# Altium schematic sheet OLED.SchDoc
size Letter
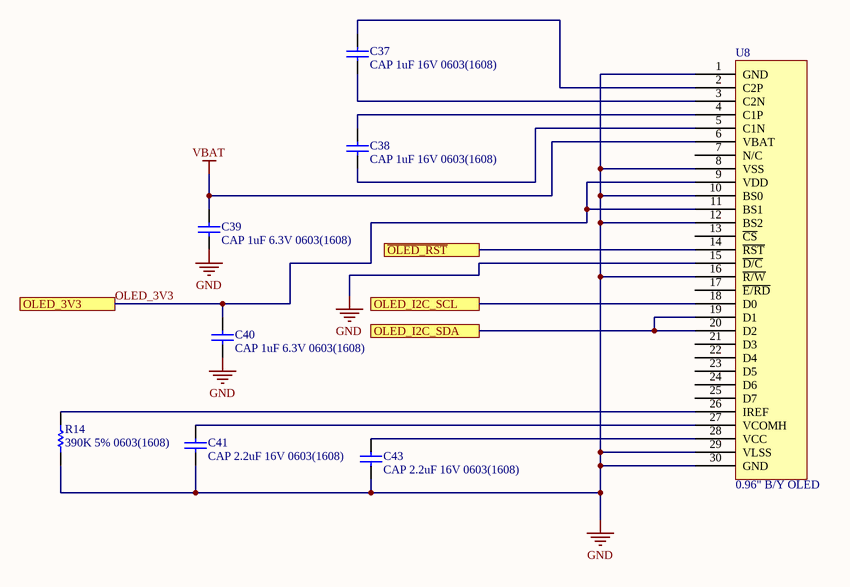
[diagram p0: OLED.SchDoc]

## Parts
C37  CAP 1uF 16V 0603(1608)  [CAPC0603(1608)100_L]
C38  CAP 1uF 16V 0603(1608)  [CAPC0603(1608)100_L]
C39  CAP 1uF 6.3V 0603(1608)  [CAPC0603(1608)100_L]
C40  CAP 1uF 6.3V 0603(1608)  [CAPC0603(1608)100_L]
C41  CAP 2.2uF 16V 0603(1608)  [CAPC0603(1608)55_L]
C43  CAP 2.2uF 16V 0603(1608)  [CAPC0603(1608)55_L]
R14  390K 5% 0603(1608)  [RESC0603(1608)_N]
U8  0.96" B/Y OLED  [0.96" B/Y OLED]

## Ports
OLED_3V3, OLED_I2C_SCL, OLED_I2C_SDA, ~{OLED_RST}

## Nets
GND: C39.1 C40.1 C41.1 C43.1 R14.1 U8.1(GND) U8.8(VSS) U8.10(BS0) U8.12(BS2) U8.15(~{D/C}) U8.16(~{R/W}) U8.29(VLSS) U8.30(GND)
VBAT: C39.2 U8.6(VBAT)
~{OLED_RST}: U8.14(~{RST}) ; port ~{OLED_RST}
OLED_3V3: C40.2 U8.9(VDD) U8.11(BS1) ; port OLED_3V3
OLED_I2C_SCL: U8.18(D0) ; port OLED_I2C_SCL
OLED_I2C_SDA: U8.19(D1) U8.20(D2) ; port OLED_I2C_SDA
NetC37_1: C37.1 U8.3(C2N)
NetC37_2: C37.2 U8.2(C2P)
NetC38_1: C38.1 U8.5(C1N)
NetC38_2: C38.2 U8.4(C1P)
NetC41_2: C41.2 U8.27(VCOMH)
NetC43_2: C43.2 U8.28(VCC)
NetR14_2: R14.2 U8.26(IREF)

Not connected (* = marked no-connect by the designer): U8 7(N/C) 13(~{CS}) 17(~{E/RD}) 21(D3) 22(D4) 23(D5) 24(D6) 25(D7)

## Notes on the sheet
- Title
- Size:
- Date:
- Letter
- Number:
- Time:
- Revision:
- Sheet
- of
- Copyright 2019
- Specialized Solutions LLC
- 206 W Lincoln Hwy STE B
- New Haven, IN 46774
- www.specsolns.com <http://www.specsolns.com>
- File:

## Library data of the parts
C37 C38 = CMP-1035-02738-1: CAP 1uF 16V ±20% 0603 (1608 Metric) Thickness 1mm SMD; Case-Metric: 1608; Case-EIA: 0603; Tolerance: Â±20%; Value: 1uF; Rated Voltage: 16 V; Max Thickness: 1 mm; Technology: SMT
C39 C40 = CMP-1035-02731-1: CAP 1uF 6.3V ±20% 0603 (1608 Metric) Thickness 1mm SMD; Case-EIA: 0603; Tolerance: Â±20%; Case-Metric: 1608; Value: 1uF; Technology: SMT; Max Thickness: 1 mm; Rated Voltage: 6.3 V
C41 C43 = CMP-1035-02764-1: CAP 2.2uF 16V ±20% 0603 (1608 Metric) Thickness 0.55mm SMD; Tolerance: Â±20%; Case-Metric: 1608; Case-EIA: 0603; Value: 2.2uF; Rated Voltage: 16 V; Max Thickness: 0.55 mm; Technology: SMT
R14 = CMP-1012-00136-1: 390K 0.1W 5% 0603 (1608 Metric)  SMD; Case-Metric: 1608; Case-EIA: 0603; Value: 390000.00 Ohm; Power: 0.1 W; Tolerance: 5 %; Technology: SMT
U8 = 0.96" B/Y OLED: 0.96" Blue/Yellow OLED 128x64 SSD1306